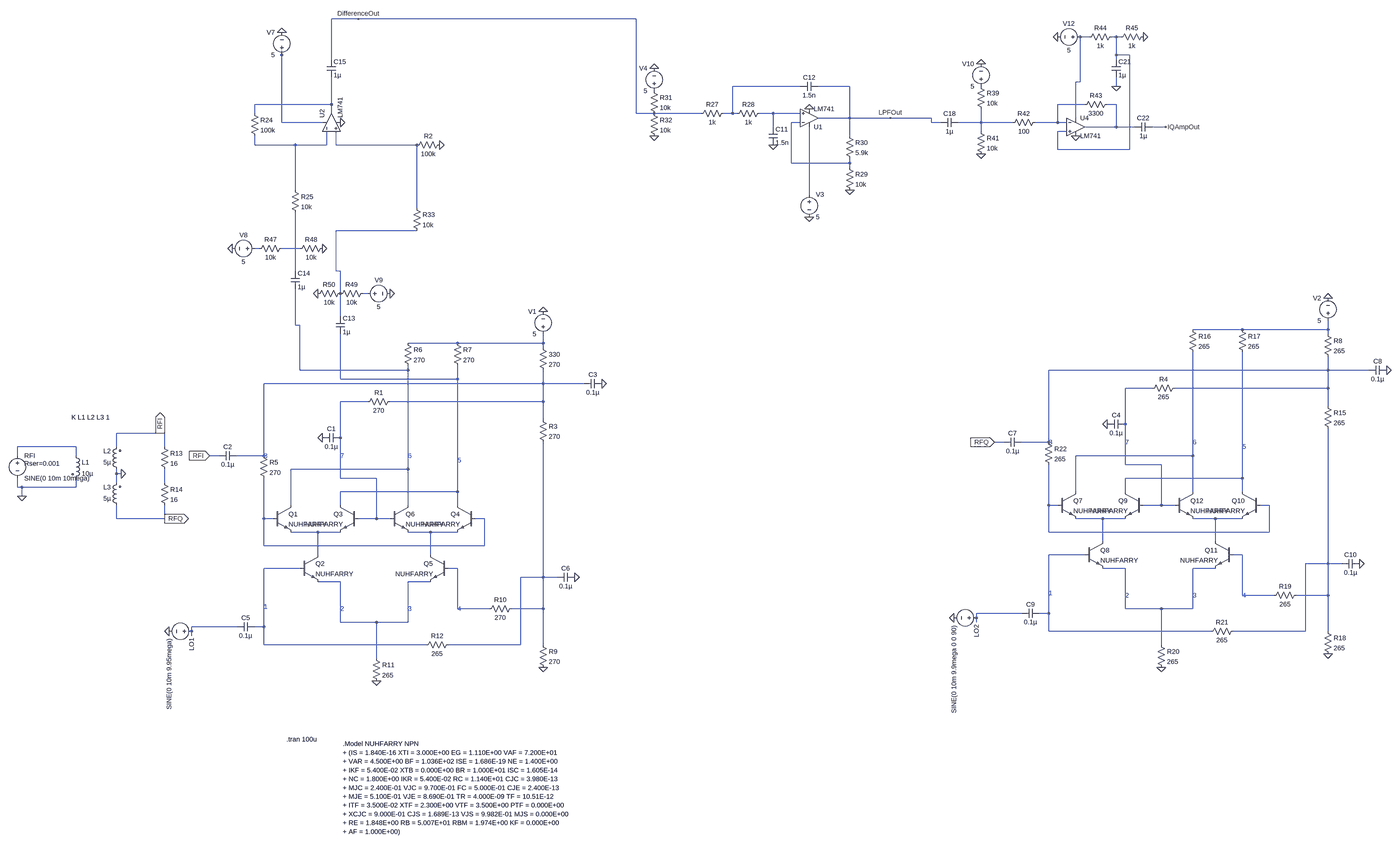
[diagram p0: schematic videocircuit.asc, whole sheet]
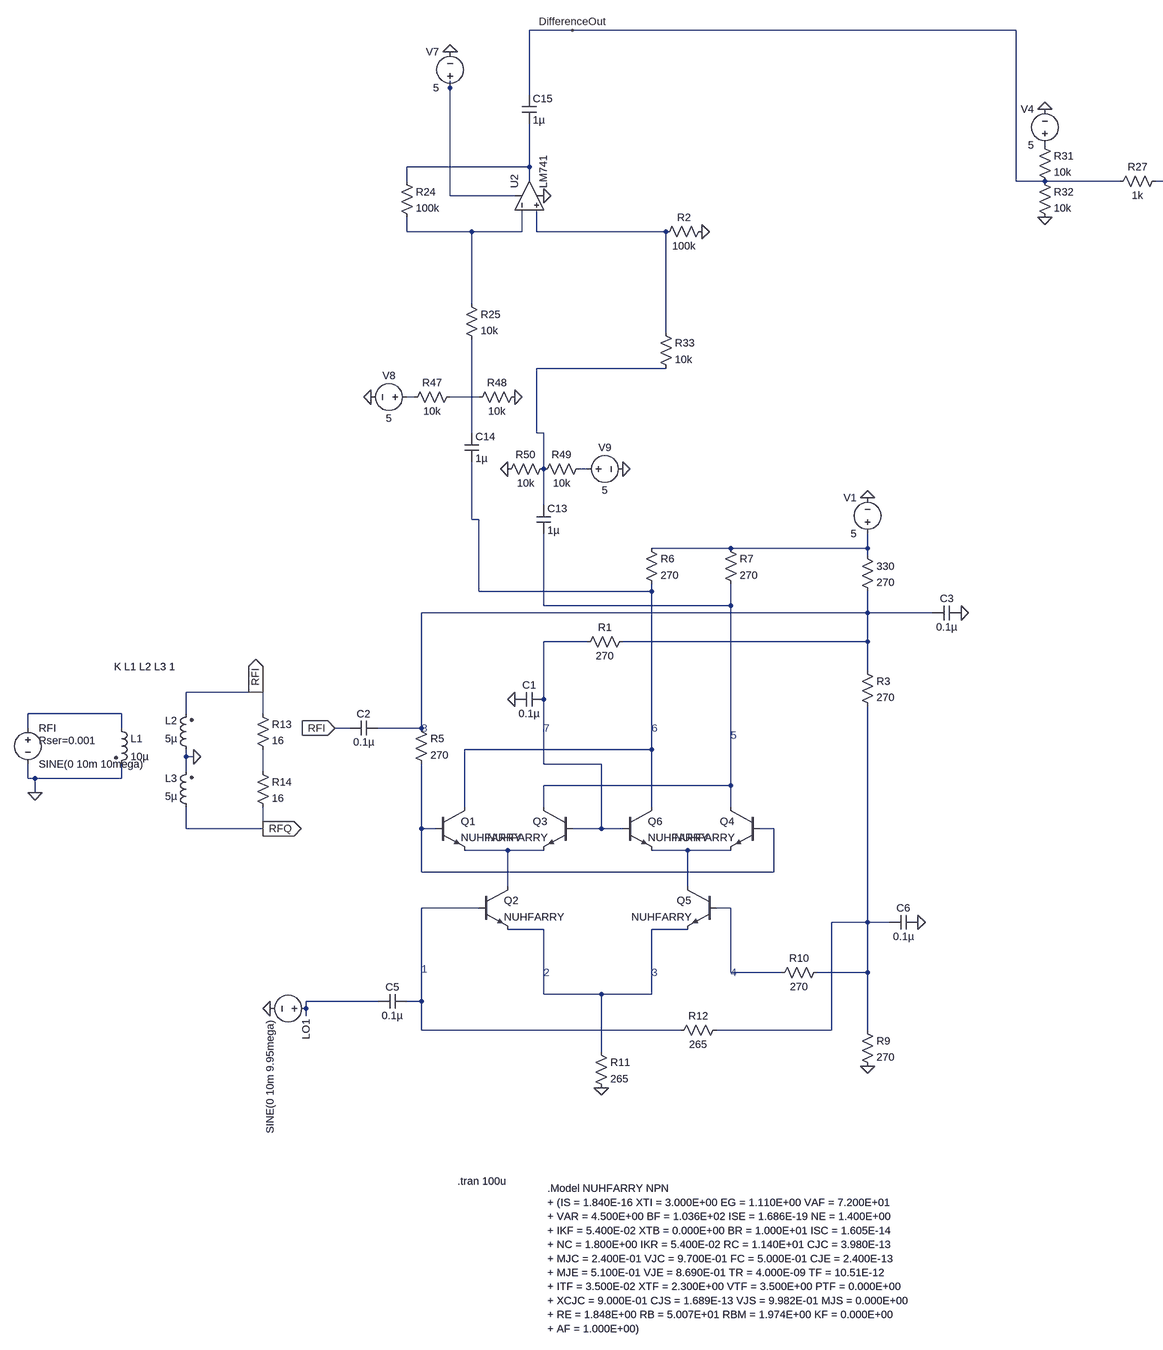
[diagram p1: schematic videocircuit.asc, part, row 1 of 1, column 1 of 2]
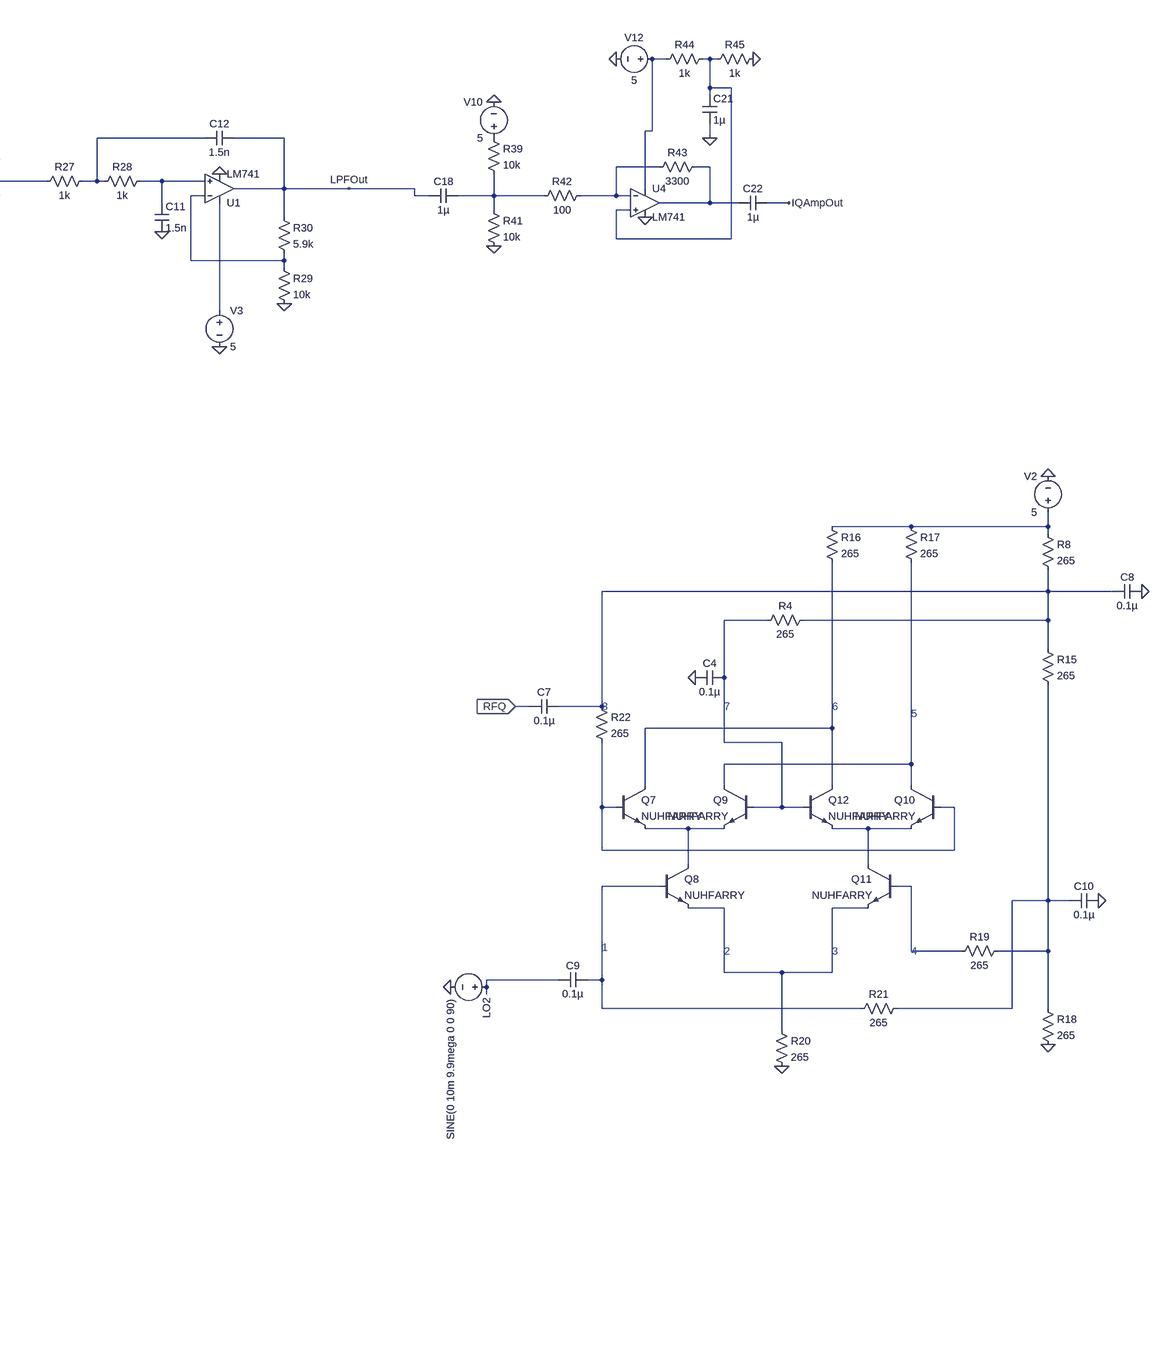
[diagram p2: schematic videocircuit.asc, part, row 1 of 1, column 2 of 2]
videocircuit.asc, the LTspice schematic file:
Version 4
SHEET 1 3876 952
WIRE -208 -1920 -304 -1920
WIRE 1040 -1920 -208 -1920
WIRE 2800 -1856 2768 -1856
WIRE 2896 -1856 2880 -1856
WIRE 2912 -1856 2896 -1856
WIRE -480 -1792 -480 -1808
WIRE 2896 -1792 2896 -1856
WIRE 2944 -1792 2896 -1792
WIRE -304 -1776 -304 -1920
WIRE 2896 -1776 2896 -1792
WIRE 2768 -1696 2768 -1856
WIRE 2768 -1696 2752 -1696
WIRE 1664 -1680 1424 -1680
WIRE 1840 -1680 1728 -1680
WIRE 2896 -1680 2896 -1712
WIRE -304 -1616 -304 -1712
WIRE -304 -1616 -576 -1616
WIRE 2784 -1616 2688 -1616
WIRE 2896 -1616 2864 -1616
WIRE -576 -1584 -576 -1616
WIRE -304 -1584 -304 -1616
WIRE 1040 -1584 1040 -1920
WIRE 1104 -1584 1040 -1584
WIRE 1312 -1584 1104 -1584
WIRE 1424 -1584 1424 -1680
WIRE 1424 -1584 1392 -1584
WIRE 1440 -1584 1424 -1584
WIRE 1568 -1584 1520 -1584
WIRE 1664 -1584 1568 -1584
WIRE 1840 -1568 1840 -1680
WIRE 1840 -1568 1728 -1568
WIRE 1984 -1568 1840 -1568
WIRE 2240 -1568 1984 -1568
WIRE 2752 -1568 2752 -1696
WIRE -480 -1552 -480 -1792
WIRE -336 -1552 -480 -1552
WIRE 1664 -1552 1632 -1552
WIRE 2240 -1552 2240 -1568
WIRE 2272 -1552 2240 -1552
WIRE 2416 -1552 2416 -1600
WIRE 2416 -1552 2336 -1552
WIRE 2528 -1552 2416 -1552
WIRE 2688 -1552 2688 -1616
WIRE 2688 -1552 2608 -1552
WIRE 2720 -1552 2688 -1552
WIRE 1568 -1536 1568 -1584
WIRE 2896 -1536 2896 -1616
WIRE 2896 -1536 2784 -1536
WIRE 2960 -1536 2896 -1536
WIRE 3072 -1536 3024 -1536
WIRE 2416 -1520 2416 -1552
WIRE 2720 -1520 2688 -1520
WIRE 1840 -1504 1840 -1568
WIRE -576 -1472 -576 -1504
WIRE -432 -1472 -576 -1472
WIRE -320 -1472 -320 -1520
WIRE -320 -1472 -432 -1472
WIRE -288 -1472 -288 -1520
WIRE 0 -1472 -288 -1472
WIRE 2688 -1456 2688 -1520
WIRE 2944 -1456 2944 -1792
WIRE 2944 -1456 2688 -1456
WIRE 1632 -1408 1632 -1552
WIRE 1840 -1408 1840 -1424
WIRE 1840 -1408 1632 -1408
WIRE 1840 -1392 1840 -1408
WIRE -432 -1312 -432 -1472
WIRE 1696 -1296 1696 -1536
WIRE 0 -1248 0 -1472
WIRE 0 -1168 -288 -1168
WIRE -560 -1104 -576 -1104
WIRE -416 -1104 -480 -1104
WIRE -432 -1024 -432 -1232
WIRE -288 -1024 -288 -1168
WIRE -272 -1024 -288 -1024
WIRE -272 -944 -272 -1024
WIRE -176 -944 -192 -944
WIRE -272 -864 -272 -944
WIRE -432 -832 -432 -960
WIRE -416 -832 -432 -832
WIRE 3344 -816 3168 -816
WIRE 3648 -816 3648 -848
WIRE 3648 -816 3344 -816
WIRE 3648 -800 3648 -816
WIRE 144 -768 -32 -768
WIRE 448 -768 448 -800
WIRE 448 -768 144 -768
WIRE 448 -752 448 -768
WIRE -416 -672 -416 -832
WIRE -32 -672 -32 -688
WIRE -32 -672 -416 -672
WIRE 3648 -672 3648 -720
WIRE 3648 -672 2656 -672
WIRE 3792 -672 3648 -672
WIRE -272 -640 -272 -800
WIRE 144 -640 144 -688
WIRE 144 -640 -272 -640
WIRE 448 -624 448 -672
WIRE 448 -624 -544 -624
WIRE 592 -624 448 -624
WIRE 3024 -608 2928 -608
WIRE 3648 -608 3648 -672
WIRE 3648 -608 3104 -608
WIRE -176 -560 -272 -560
WIRE 448 -560 448 -624
WIRE 448 -560 -96 -560
WIRE 3648 -544 3648 -608
WIRE 448 -496 448 -560
WIRE 2928 -480 2928 -608
WIRE -912 -448 -1120 -448
WIRE -896 -448 -912 -448
WIRE -272 -432 -272 -560
WIRE 2496 -416 2464 -416
WIRE 2656 -416 2656 -672
WIRE 2656 -416 2560 -416
WIRE -1264 -400 -1472 -400
WIRE -1120 -400 -1120 -448
WIRE -896 -400 -896 -448
WIRE -1472 -368 -1472 -400
WIRE -1264 -368 -1264 -400
WIRE -704 -368 -736 -368
WIRE -544 -368 -544 -624
WIRE -544 -368 -640 -368
WIRE 3168 -368 3168 -736
WIRE 3168 -368 2752 -368
WIRE 2928 -336 2928 -480
WIRE 3056 -336 2928 -336
WIRE -32 -320 -32 -672
WIRE -32 -320 -448 -320
WIRE -1120 -304 -1120 -320
WIRE -1104 -304 -1120 -304
WIRE -272 -288 -272 -432
WIRE -144 -288 -272 -288
WIRE 3344 -288 3344 -736
WIRE 3344 -288 2928 -288
WIRE -1120 -272 -1120 -304
WIRE -896 -272 -896 -320
WIRE -1472 -256 -1472 -288
WIRE -1456 -256 -1472 -256
WIRE -1264 -256 -1264 -288
WIRE -1264 -256 -1456 -256
WIRE 144 -240 144 -640
WIRE 144 -240 -272 -240
WIRE 2752 -240 2752 -368
WIRE 2928 -240 2928 -288
WIRE 3168 -240 3168 -368
WIRE 3344 -240 3344 -288
WIRE -1456 -224 -1456 -256
WIRE -448 -192 -448 -320
WIRE -272 -192 -272 -240
WIRE -32 -192 -32 -320
WIRE 144 -192 144 -240
WIRE 2656 -192 2656 -336
WIRE 2688 -192 2656 -192
WIRE 3056 -192 3056 -336
WIRE 3056 -192 2992 -192
WIRE 3104 -192 3056 -192
WIRE 3440 -192 3408 -192
WIRE -1120 -144 -1120 -192
WIRE -896 -144 -896 -192
WIRE -896 -144 -1120 -144
WIRE -544 -144 -544 -288
WIRE -512 -144 -544 -144
WIRE -144 -144 -144 -288
WIRE -144 -144 -208 -144
WIRE -96 -144 -144 -144
WIRE 240 -144 208 -144
WIRE 2848 -144 2752 -144
WIRE 2928 -144 2848 -144
WIRE 3248 -144 3168 -144
WIRE 3344 -144 3248 -144
WIRE -352 -96 -448 -96
WIRE -272 -96 -352 -96
WIRE 48 -96 -32 -96
WIRE 144 -96 48 -96
WIRE 2656 -96 2656 -192
WIRE 3440 -96 3440 -192
WIRE 3440 -96 2656 -96
WIRE 2848 -64 2848 -144
WIRE 3248 -64 3248 -144
WIRE -544 -48 -544 -144
WIRE 240 -48 240 -144
WIRE 240 -48 -544 -48
WIRE -352 -16 -352 -96
WIRE 48 -16 48 -96
WIRE 2784 -16 2656 -16
WIRE 3344 -16 3312 -16
WIRE 3648 16 3648 -464
WIRE 3648 16 3568 16
WIRE 3696 16 3648 16
WIRE -416 32 -544 32
WIRE 144 32 112 32
WIRE 2928 32 2848 32
WIRE 3248 32 3168 32
WIRE 448 64 448 -416
WIRE 448 64 368 64
WIRE 496 64 448 64
WIRE -272 80 -352 80
WIRE 48 80 -32 80
WIRE 3344 128 3344 -16
WIRE 3456 128 3344 128
WIRE 3648 128 3648 16
WIRE 3648 128 3536 128
WIRE 144 176 144 32
WIRE 256 176 144 176
WIRE 448 176 448 64
WIRE 448 176 336 176
WIRE 2928 176 2928 32
WIRE 3056 176 2928 176
WIRE 3168 176 3168 32
WIRE 3168 176 3056 176
WIRE 2560 192 2400 192
WIRE 2656 192 2656 -16
WIRE 2656 192 2624 192
WIRE 2400 208 2400 192
WIRE -272 224 -272 80
WIRE -144 224 -272 224
WIRE -32 224 -32 80
WIRE -32 224 -144 224
WIRE 2400 224 2400 208
WIRE -640 240 -800 240
WIRE -544 240 -544 32
WIRE -544 240 -576 240
WIRE -800 256 -800 240
WIRE 2656 256 2656 192
WIRE 3232 256 2656 256
WIRE 3568 256 3568 16
WIRE 3568 256 3312 256
WIRE 3648 256 3648 128
WIRE -800 272 -800 256
WIRE -544 304 -544 240
WIRE 32 304 -544 304
WIRE 368 304 368 64
WIRE 368 304 112 304
WIRE 448 304 448 176
WIRE 3056 304 3056 176
WIRE -144 352 -144 224
FLAG -336 -432 0
FLAG 448 -880 0
FLAG 656 -624 0
FLAG -880 256 0
FLAG 448 384 0
FLAG -144 432 0
FLAG 560 64 0
FLAG -1104 -304 0
FLAG -1456 -224 0
FLAG -912 -448 RFI
IOPIN -912 -448 Out
FLAG -896 -144 RFQ
IOPIN -896 -144 Out
FLAG 1840 -1312 0
FLAG 1568 -1472 0
FLAG 1696 -1216 0
FLAG 1104 -1744 0
FLAG 1104 -1504 0
FLAG -736 -368 RFI
IOPIN -736 -368 In
FLAG 2864 -480 0
FLAG 3648 -928 0
FLAG 3856 -672 0
FLAG 3648 336 0
FLAG 3056 384 0
FLAG 3760 16 0
FLAG 2464 -416 RFQ
IOPIN 2464 -416 In
FLAG 2320 208 0
FLAG 80 -1472 0
FLAG 2752 -1504 0
FLAG 2416 -1440 0
FLAG 2416 -1760 0
FLAG 2688 -1856 0
FLAG 2992 -1856 0
FLAG 2896 -1680 0
FLAG -272 -1552 0
FLAG -480 -1872 0
FLAG -336 -1104 0
FLAG -656 -1104 0
FLAG -352 -944 0
FLAG -96 -944 0
FLAG -208 -1920 DifferenceOut
FLAG 1984 -1568 LPFOut
FLAG 3072 -1536 IQAmpOut
FLAG 1696 -1600 0
SYMBOL npn -512 -192 R0
SYMATTR InstName Q1
SYMATTR Value NUHFARRY
SYMBOL npn -416 -16 R0
SYMATTR InstName Q2
SYMATTR Value NUHFARRY
SYMBOL npn -208 -192 M0
SYMATTR InstName Q3
SYMATTR Value NUHFARRY
SYMBOL npn 208 -192 M0
SYMATTR InstName Q4
SYMATTR Value NUHFARRY
SYMBOL npn 112 -16 M0
SYMATTR InstName Q5
SYMATTR Value NUHFARRY
SYMBOL npn -96 -192 R0
SYMATTR InstName Q6
SYMATTR Value NUHFARRY
SYMBOL cap -272 -448 R90
WINDOW 0 0 32 VBottom 2
WINDOW 3 32 32 VTop 2
SYMATTR InstName C1
SYMATTR Value 0.1µ
SYMBOL res -80 -576 R90
WINDOW 0 0 56 VBottom 2
WINDOW 3 32 56 VTop 2
SYMATTR InstName R1
SYMATTR Value 270
SYMBOL voltage 448 -784 R180
WINDOW 0 24 96 Left 2
WINDOW 3 24 16 Left 2
WINDOW 123 0 0 Left 0
WINDOW 39 0 0 Left 0
SYMATTR InstName V1
SYMATTR Value 5
SYMBOL res 432 -768 R0
SYMATTR InstName 330
SYMATTR Value 270
SYMBOL res 432 -512 R0
SYMATTR InstName R3
SYMATTR Value 270
SYMBOL cap -640 -384 R90
WINDOW 0 0 32 VBottom 2
WINDOW 3 32 32 VTop 2
SYMATTR InstName C2
SYMATTR Value 0.1µ
SYMBOL voltage -1472 -384 R0
WINDOW 123 0 0 Left 0
WINDOW 39 24 44 Left 2
SYMATTR SpiceLine Rser=0.001
SYMATTR InstName RFI
SYMATTR Value SINE(0 10m 10mega)
SYMBOL cap 656 -640 R90
WINDOW 0 0 32 VBottom 2
WINDOW 3 32 32 VTop 2
SYMATTR InstName C3
SYMATTR Value 0.1µ
SYMBOL res -48 -784 R0
SYMATTR InstName R6
SYMATTR Value 270
SYMBOL res 128 -784 R0
SYMATTR InstName R7
SYMATTR Value 270
SYMBOL voltage -784 256 R90
WINDOW 123 0 0 Left 0
WINDOW 39 0 0 Left 0
SYMATTR InstName LO1
SYMATTR Value SINE(0 10m 9.95mega)
SYMBOL cap -576 224 R90
WINDOW 0 0 32 VBottom 2
WINDOW 3 32 32 VTop 2
SYMATTR InstName C5
SYMATTR Value 0.1µ
SYMBOL res 432 288 R0
SYMATTR InstName R9
SYMATTR Value 270
SYMBOL res 352 160 R90
WINDOW 0 0 56 VBottom 2
WINDOW 3 32 56 VTop 2
SYMATTR InstName R10
SYMATTR Value 270
SYMBOL res -160 336 R0
SYMATTR InstName R11
SYMATTR Value 265
SYMBOL cap 560 48 R90
WINDOW 0 0 32 VBottom 2
WINDOW 3 32 32 VTop 2
SYMATTR InstName C6
SYMATTR Value 0.1µ
SYMBOL res 128 288 R90
WINDOW 0 0 56 VBottom 2
WINDOW 3 32 56 VTop 2
SYMATTR InstName R12
SYMATTR Value 265
SYMBOL res -560 -384 R0
SYMATTR InstName R5
SYMATTR Value 270
SYMBOL ind2 -1280 -384 R0
SYMATTR InstName L1
SYMATTR Value 10µ
SYMATTR Type ind
SYMBOL ind2 -1104 -304 R180
WINDOW 0 36 80 Left 2
WINDOW 3 36 40 Left 2
SYMATTR InstName L2
SYMATTR Value 5µ
SYMATTR Type ind
SYMBOL ind2 -1104 -176 R180
WINDOW 0 36 80 Left 2
WINDOW 3 36 40 Left 2
SYMATTR InstName L3
SYMATTR Value 5µ
SYMATTR Type ind
SYMBOL res -912 -416 R0
SYMATTR InstName R13
SYMATTR Value 16
SYMBOL res -912 -288 R0
SYMATTR InstName R14
SYMATTR Value 16
SYMBOL res 1408 -1600 R90
WINDOW 0 0 56 VBottom 2
WINDOW 3 32 56 VTop 2
SYMATTR InstName R27
SYMATTR Value 1k
SYMBOL res 1536 -1600 R90
WINDOW 0 0 56 VBottom 2
WINDOW 3 32 56 VTop 2
SYMATTR InstName R28
SYMATTR Value 1k
SYMBOL cap 1552 -1536 R0
SYMATTR InstName C11
SYMATTR Value 1.5n
SYMBOL LM741 1696 -1504 M180
SYMATTR InstName U1
SYMBOL voltage 1696 -1312 R0
WINDOW 123 0 0 Left 0
WINDOW 39 0 0 Left 0
SYMATTR InstName V3
SYMATTR Value 5
SYMBOL cap 1728 -1696 R90
WINDOW 0 0 32 VBottom 2
WINDOW 3 32 32 VTop 2
SYMATTR InstName C12
SYMATTR Value 1.5n
SYMBOL res 1824 -1408 R0
SYMATTR InstName R29
SYMATTR Value 10k
SYMBOL res 1824 -1520 R0
SYMATTR InstName R30
SYMATTR Value 5.9k
SYMBOL res 1088 -1680 R0
SYMATTR InstName R31
SYMATTR Value 10k
SYMBOL res 1088 -1600 R0
SYMATTR InstName R32
SYMATTR Value 10k
SYMBOL voltage 1104 -1648 R180
WINDOW 0 24 96 Left 2
WINDOW 3 24 16 Left 2
WINDOW 123 0 0 Left 0
WINDOW 39 0 0 Left 0
SYMATTR InstName V4
SYMATTR Value 5
SYMBOL npn 2688 -240 R0
SYMATTR InstName Q7
SYMATTR Value NUHFARRY
SYMBOL npn 2784 -64 R0
SYMATTR InstName Q8
SYMATTR Value NUHFARRY
SYMBOL npn 2992 -240 M0
SYMATTR InstName Q9
SYMATTR Value NUHFARRY
SYMBOL npn 3408 -240 M0
SYMATTR InstName Q10
SYMATTR Value NUHFARRY
SYMBOL npn 3312 -64 M0
SYMATTR InstName Q11
SYMATTR Value NUHFARRY
SYMBOL npn 3104 -240 R0
SYMATTR InstName Q12
SYMATTR Value NUHFARRY
SYMBOL cap 2928 -496 R90
WINDOW 0 0 32 VBottom 2
WINDOW 3 32 32 VTop 2
SYMATTR InstName C4
SYMATTR Value 0.1µ
SYMBOL res 3120 -624 R90
WINDOW 0 0 56 VBottom 2
WINDOW 3 32 56 VTop 2
SYMATTR InstName R4
SYMATTR Value 265
SYMBOL voltage 3648 -832 R180
WINDOW 0 24 96 Left 2
WINDOW 3 24 16 Left 2
WINDOW 123 0 0 Left 0
WINDOW 39 0 0 Left 0
SYMATTR InstName V2
SYMATTR Value 5
SYMBOL res 3632 -816 R0
SYMATTR InstName R8
SYMATTR Value 265
SYMBOL res 3632 -560 R0
SYMATTR InstName R15
SYMATTR Value 265
SYMBOL cap 2560 -432 R90
WINDOW 0 0 32 VBottom 2
WINDOW 3 32 32 VTop 2
SYMATTR InstName C7
SYMATTR Value 0.1µ
SYMBOL cap 3856 -688 R90
WINDOW 0 0 32 VBottom 2
WINDOW 3 32 32 VTop 2
SYMATTR InstName C8
SYMATTR Value 0.1µ
SYMBOL res 3152 -832 R0
SYMATTR InstName R16
SYMATTR Value 265
SYMBOL res 3328 -832 R0
SYMATTR InstName R17
SYMATTR Value 265
SYMBOL cap 2624 176 R90
WINDOW 0 0 32 VBottom 2
WINDOW 3 32 32 VTop 2
SYMATTR InstName C9
SYMATTR Value 0.1µ
SYMBOL res 3632 240 R0
SYMATTR InstName R18
SYMATTR Value 265
SYMBOL res 3552 112 R90
WINDOW 0 0 56 VBottom 2
WINDOW 3 32 56 VTop 2
SYMATTR InstName R19
SYMATTR Value 265
SYMBOL res 3040 288 R0
SYMATTR InstName R20
SYMATTR Value 265
SYMBOL cap 3760 0 R90
WINDOW 0 0 32 VBottom 2
WINDOW 3 32 32 VTop 2
SYMATTR InstName C10
SYMATTR Value 0.1µ
SYMBOL res 3328 240 R90
WINDOW 0 0 56 VBottom 2
WINDOW 3 32 56 VTop 2
SYMATTR InstName R21
SYMATTR Value 265
SYMBOL res 2640 -432 R0
SYMATTR InstName R22
SYMATTR Value 265
SYMBOL voltage 2416 208 R90
WINDOW 123 0 0 Left 0
WINDOW 39 0 0 Left 0
SYMATTR InstName LO2
SYMATTR Value SINE(0 10m 9.9mega 0 0 90)
SYMBOL res -448 -1328 R0
SYMATTR InstName R25
SYMATTR Value 10k
SYMBOL LM741 -368 -1552 R270
SYMATTR InstName U2
SYMBOL cap -320 -1776 R0
SYMATTR InstName C15
SYMATTR Value 1µ
SYMBOL res -16 -1264 R0
SYMATTR InstName R33
SYMATTR Value 10k
SYMBOL res 96 -1488 R90
WINDOW 0 0 56 VBottom 2
WINDOW 3 32 56 VTop 2
SYMATTR InstName R2
SYMATTR Value 100k
SYMBOL res 2400 -1696 R0
SYMATTR InstName R39
SYMATTR Value 10k
SYMBOL res 2400 -1536 R0
SYMATTR InstName R41
SYMATTR Value 10k
SYMBOL res 2624 -1568 R90
WINDOW 0 0 56 VBottom 2
WINDOW 3 32 56 VTop 2
SYMATTR InstName R42
SYMATTR Value 100
SYMBOL LM741 2752 -1600 R0
SYMATTR InstName U4
SYMBOL voltage 2416 -1664 R180
WINDOW 0 24 96 Left 2
WINDOW 3 24 16 Left 2
WINDOW 123 0 0 Left 0
WINDOW 39 0 0 Left 0
SYMATTR InstName V10
SYMATTR Value 5
SYMBOL res 2880 -1632 R90
WINDOW 0 0 56 VBottom 2
WINDOW 3 32 56 VTop 2
SYMATTR InstName R43
SYMATTR Value 3300
SYMBOL voltage 2784 -1856 R90
WINDOW 0 -32 56 VBottom 2
WINDOW 3 32 56 VTop 2
WINDOW 123 0 0 Left 0
WINDOW 39 0 0 Left 0
SYMATTR InstName V12
SYMATTR Value 5
SYMBOL res 2896 -1872 R90
WINDOW 0 0 56 VBottom 2
WINDOW 3 32 56 VTop 2
SYMATTR InstName R44
SYMATTR Value 1k
SYMBOL res 3008 -1872 R90
WINDOW 0 0 56 VBottom 2
WINDOW 3 32 56 VTop 2
SYMATTR InstName R45
SYMATTR Value 1k
SYMBOL cap 2336 -1568 R90
WINDOW 0 0 32 VBottom 2
WINDOW 3 32 32 VTop 2
SYMATTR InstName C18
SYMATTR Value 1µ
SYMBOL cap 2880 -1776 R0
SYMATTR InstName C21
SYMATTR Value 1µ
SYMBOL cap 3024 -1552 R90
WINDOW 0 0 32 VBottom 2
WINDOW 3 32 32 VTop 2
SYMATTR InstName C22
SYMATTR Value 1µ
SYMBOL res -592 -1600 R0
SYMATTR InstName R24
SYMATTR Value 100k
SYMBOL voltage -480 -1776 R180
WINDOW 0 24 96 Left 2
WINDOW 3 24 16 Left 2
WINDOW 123 0 0 Left 0
WINDOW 39 0 0 Left 0
SYMATTR InstName V7
SYMATTR Value 5
SYMBOL res -464 -1120 R90
WINDOW 0 0 56 VBottom 2
WINDOW 3 32 56 VTop 2
SYMATTR InstName R47
SYMATTR Value 10k
SYMBOL res -320 -1120 R90
WINDOW 0 0 56 VBottom 2
WINDOW 3 32 56 VTop 2
SYMATTR InstName R48
SYMATTR Value 10k
SYMBOL voltage -560 -1104 R90
WINDOW 0 -32 56 VBottom 2
WINDOW 3 32 56 VTop 2
WINDOW 123 0 0 Left 0
WINDOW 39 0 0 Left 0
SYMATTR InstName V8
SYMATTR Value 5
SYMBOL voltage -192 -944 R270
WINDOW 0 32 56 VTop 2
WINDOW 3 -32 56 VBottom 2
WINDOW 123 0 0 Left 0
WINDOW 39 0 0 Left 0
SYMATTR InstName V9
SYMATTR Value 5
SYMBOL res -176 -960 R90
WINDOW 0 0 56 VBottom 2
WINDOW 3 32 56 VTop 2
SYMATTR InstName R49
SYMATTR Value 10k
SYMBOL res -256 -960 R90
WINDOW 0 0 56 VBottom 2
WINDOW 3 32 56 VTop 2
SYMATTR InstName R50
SYMATTR Value 10k
SYMBOL cap -448 -1024 R0
SYMATTR InstName C14
SYMATTR Value 1µ
SYMBOL cap -288 -864 R0
SYMATTR InstName C13
SYMATTR Value 1µ
TEXT 144 -352 Left 2 ;5
TEXT -32 -368 Left 2 ;6
TEXT -272 -368 Left 2 ;7
TEXT -544 -368 Left 2 ;8
TEXT -544 168 Left 2 ;1
TEXT -272 176 Left 2 ;2
TEXT -32 176 Left 2 ;3
TEXT 144 176 Left 2 ;4
TEXT -464 640 Left 2 !.tran 100u
TEXT -1280 -504 Left 2 !K L1 L2 L3 1
TEXT -264 656 Left 2 !.Model NUHFARRY NPN\n+ (IS = 1.840E-16 XTI = 3.000E+00 EG = 1.110E+00 VAF = 7.200E+01\n+ VAR = 4.500E+00 BF = 1.036E+02 ISE = 1.686E-19 NE = 1.400E+00\n+ IKF = 5.400E-02 XTB = 0.000E+00 BR = 1.000E+01 ISC = 1.605E-14\n+ NC = 1.800E+00 IKR = 5.400E-02 RC = 1.140E+01 CJC = 3.980E-13\n+ MJC = 2.400E-01 VJC = 9.700E-01 FC = 5.000E-01 CJE = 2.400E-13\n+ MJE = 5.100E-01 VJE = 8.690E-01 TR = 4.000E-09 TF = 10.51E-12\n+ ITF = 3.500E-02 XTF = 2.300E+00 VTF = 3.500E+00 PTF = 0.000E+00\n+ XCJC = 9.000E-01 CJS = 1.689E-13 VJS = 9.982E-01 MJS = 0.000E+00\n+ RE = 1.848E+00 RB = 5.007E+01 RBM = 1.974E+00 KF = 0.000E+00\n+ AF = 1.000E+00)
TEXT 3344 -400 Left 2 ;5
TEXT 3168 -416 Left 2 ;6
TEXT 2928 -416 Left 2 ;7
TEXT 2656 -416 Left 2 ;8
TEXT 2656 120 Left 2 ;1
TEXT 2928 128 Left 2 ;2
TEXT 3168 128 Left 2 ;3
TEXT 3344 128 Left 2 ;4

The netlist it stands for:
* videocircuit.asc
Q1 N019 N032 N035 0 NUHFARRY
Q2 N035 N040 N044 0 NUHFARRY
Q3 N023 N026 N035 0 NUHFARRY
Q4 N023 N032 N036 0 NUHFARRY
Q5 N036 N041 N044 0 NUHFARRY
Q6 N019 N026 N036 0 NUHFARRY
C1 N026 0 0.1µ
R1 N024 N026 270
V1 N021 0 5
R§330 N021 N024 270
R3 N024 N043 270
C2 N024 RFI 0.1µ
V§RFI N027 0 SINE(0 10m 10mega) Rser=0.001
C3 0 N024 0.1µ
R6 N021 N019 270
R7 N021 N023 270
V§LO1 N046 0 SINE(0 10m 9.95mega)
C5 N040 N046 0.1µ
R9 N043 0 270
R10 N043 N041 270
R11 N044 0 265
C6 0 N043 0.1µ
R12 N043 N040 265
R5 N024 N032 270
L1 N027 0 10µ
L2 0 RFI 5µ
L3 RFQ 0 5µ
R13 RFI N030 16
R14 N030 RFQ 16
R27 N004 DifferenceOut 1k
R28 N008 N004 1k
C11 N008 0 1.5n
XU1 N008 N009 N013 0 LPFOut LM741  ; pins In+ In- V+ V- OUT
V3 N013 0 5
C12 LPFOut N004 1.5n
R29 N009 0 10k
R30 LPFOut N009 5.9k
R31 P001 DifferenceOut 10k
R32 DifferenceOut 0 10k
V4 P001 0 5
Q7 N028 N031 N033 0 NUHFARRY
Q8 N033 N037 N042 0 NUHFARRY
Q9 N029 N025 N033 0 NUHFARRY
Q10 N029 N031 N034 0 NUHFARRY
Q11 N034 N038 N042 0 NUHFARRY
Q12 N028 N025 N034 0 NUHFARRY
C4 N025 0 0.1µ
R4 N022 N025 265
V2 N020 0 5
R8 N020 N022 265
R15 N022 N039 265
C7 N022 RFQ 0.1µ
C8 0 N022 0.1µ
R16 N020 N028 265
R17 N020 N029 265
C9 N037 N045 0.1µ
R18 N039 0 265
R19 N039 N038 265
R20 N042 0 265
C10 0 N039 0.1µ
R21 N039 N037 265
R22 N022 N031 265
V§LO2 N045 0 SINE(0 10m 9.9mega 0 0 90)
R25 N011 N017 10k
XU2 N012 N011 N003 0 N005 LM741  ; pins In+ In- V+ V- OUT
C15 DifferenceOut N005 1µ
R33 N012 N014 10k
R2 0 N012 100k
R39 P002 N010 10k
R41 N010 0 10k
R42 N006 N010 100
XU4 N002 N006 N001 0 N007 LM741  ; pins In+ In- V+ V- OUT
V10 P002 0 5
R43 N007 N006 3300
V12 N001 0 5
R44 N002 N001 1k
R45 0 N002 1k
C18 N010 LPFOut 1µ
C21 N002 0 1µ
C22 IQAmpOut N007 1µ
R24 N005 N011 100k
V7 N003 0 5
R47 N016 N015 10k
R48 0 N016 10k
V8 N015 0 5
V9 N018 0 5
R49 N018 N014 10k
R50 N014 0 10k
C14 N017 N019 1µ
C13 N014 N023 1µ
.model NPN NPN
.model PNP PNP
.lib standard.bjt
* 5
* 6
* 7
* 8
* 1
* 2
* 3
* 4
.tran 100u
K L1 L2 L3 1
.Model NUHFARRY NPN
+ (IS = 1.840E-16 XTI = 3.000E+00 EG = 1.110E+00 VAF = 7.200E+01
+ VAR = 4.500E+00 BF = 1.036E+02 ISE = 1.686E-19 NE = 1.400E+00
+ IKF = 5.400E-02 XTB = 0.000E+00 BR = 1.000E+01 ISC = 1.605E-14
+ NC = 1.800E+00 IKR = 5.400E-02 RC = 1.140E+01 CJC = 3.980E-13
+ MJC = 2.400E-01 VJC = 9.700E-01 FC = 5.000E-01 CJE = 2.400E-13
+ MJE = 5.100E-01 VJE = 8.690E-01 TR = 4.000E-09 TF = 10.51E-12
+ ITF = 3.500E-02 XTF = 2.300E+00 VTF = 3.500E+00 PTF = 0.000E+00
+ XCJC = 9.000E-01 CJS = 1.689E-13 VJS = 9.982E-01 MJS = 0.000E+00
+ RE = 1.848E+00 RB = 5.007E+01 RBM = 1.974E+00 KF = 0.000E+00
+ AF = 1.000E+00)
* 5
* 6
* 7
* 8
* 1
* 2
* 3
* 4
.lib LM741.lib
.backanno
.end